# EAGLE design pardyBuzz (EAGLE 6.5.0)
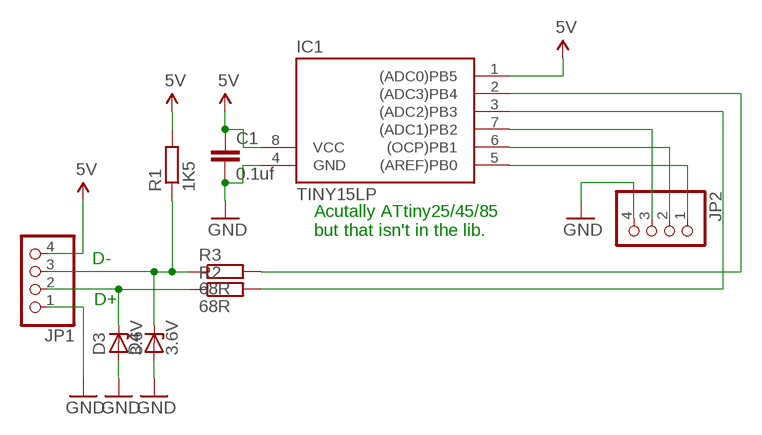
[diagram p0: schematic, sheet 1]

## Parts
C1  0.1uf  C-EU050-024X044  [C050-024X044]
D3  3.6V  ZENER-DIODEDO34-7  [DO34Z7]
D4  3.6V  ZENER-DIODEDO34-7  [DO34Z7]
IC1  TINY15LP  [DIL08]
JP1  PINHD-1X4  [1X04]
JP2  PINHD-1X4  [1X04]
R1  1K5  R-EU_0204/2V  [0204V]
R2  68R  R-EU_0204/2V  [0204V]
R3  68R  R-EU_0204/2V  [0204V]

## Nets
5V: C1.1 IC1.1((ADC0)PB5) IC1.8(VCC) JP1.4 R1.2
GND: C1.2 D3.A D4.A IC1.4(GND) JP1.1 JP2.4
N$1: IC1.3((ADC2)PB3) R2.2
N$2: D4.C JP1.3 R1.1 R3.1
N$3: D3.C JP1.2 R2.1
N$4: IC1.7((ADC1)PB2) JP2.3
N$5: IC1.6((OCP)PB1) JP2.2
N$6: IC1.2((ADC3)PB4) R3.2
N$7: IC1.5((AREF)PB0) JP2.1

## Notes on the sheet
- Acutally ATtiny25/45/85
  but that isn't in the lib.
- D-
- D+

## Library data of the parts
C1 = rcl:C-EU: CAPACITOR, European symbol
D3 D4 = diode:ZENER-DIODE: Z-Diode
IC1 = atmel:TINY15L: MICROCONTROLLER 2.7 V 1 Kbytes FLASH 64 bytes EEPROM 4-channel 10 bit ADC; OC_FARNELL: unknown; OC_NEWARK: unknown
JP1 JP2 = pinhead:PINHD-1X4: PIN HEADER
R1-R3 = rcl:R-EU_: RESISTOR, European symbol

## Board
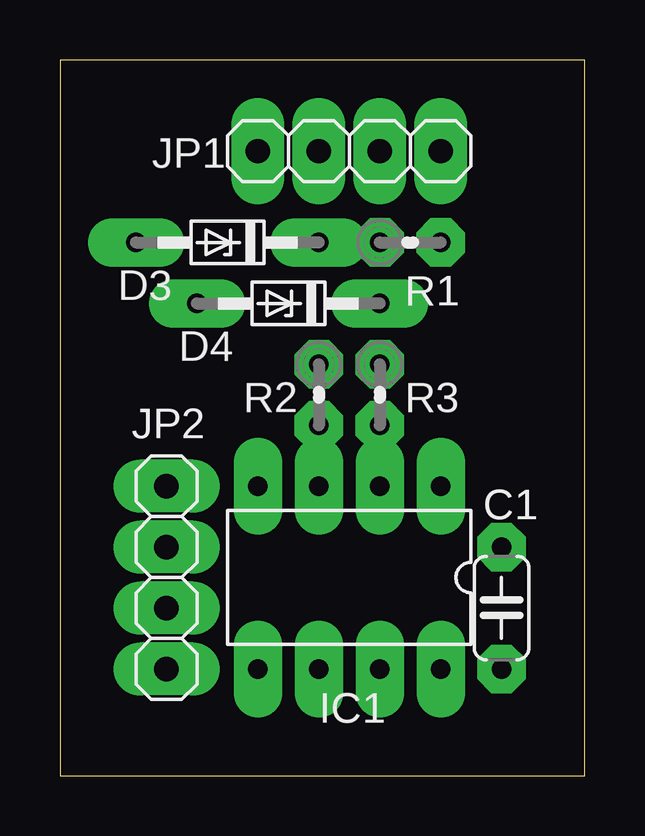
[diagram p1: board, top side]
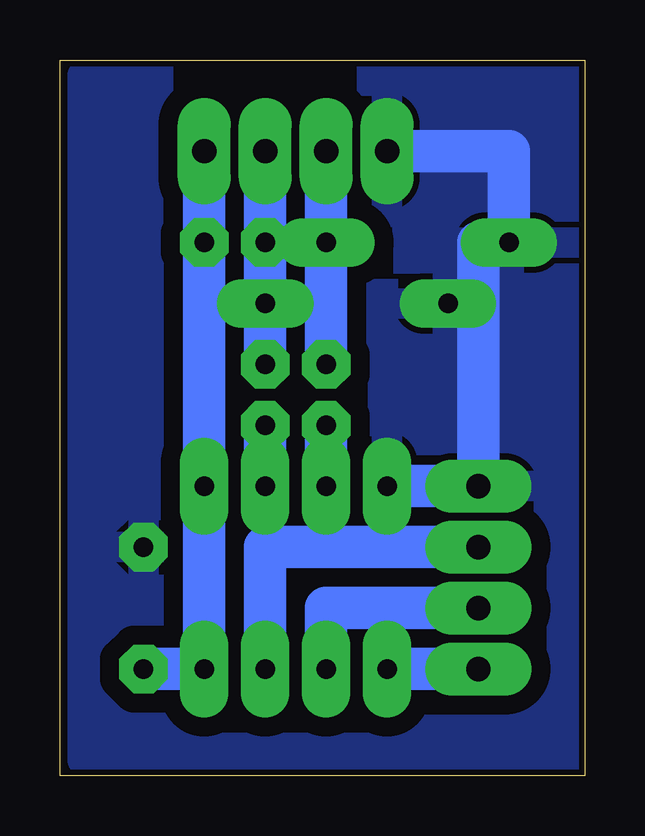
[diagram p2: board, bottom side, seen from below]

Size 21.89 x 29.84 mm. Coordinates in mm from the lower left corner, seen from the top.
Outline: 0,0 21.89,0 21.89,29.84 0,29.84 0,0
Copper layers (1*16): Top 0.035mm / dielectric 1.5mm / Bottom 0.035mm
Design rules "hobby": minimum track width 0.8mm, minimum drill 0.8mm, track to track 0.8mm, track to pad 0.8mm, pad to pad 0.45mm, via to via 0.8mm, smd to smd 8mil, copper to edge 10mil, drill to drill 8mil, minimum pad ring 0.6mm, minimum via ring 0.6mm, stop-mask expansion 0mil, vias tented up to drill 0mil, thermal gap 10mil

### Footprints (pad centres in the part's own frame; a part is rotated, then mirrored left to right if it is on the bottom)
C050-024X044 = drill 0.813 octagon: 1 -2.54,0; 2 2.54,0
DO34Z7 = drill 0.813 long: A 3.81,0; C -3.81,0
DIL08 = drill 0.813 long: 1 -3.81,-3.81; 2 -1.27,-3.81; 3 1.27,-3.81; 4 3.81,-3.81; 5 3.81,3.81; 6 1.27,3.81; 7 -1.27,3.81; 8 -3.81,3.81
1X04 = drill 1.016 long: 1 -3.81,0; 2 -1.27,0; 3 1.27,0; 4 3.81,0
0204V = drill 0.813 octagon: 1 -1.27,0; 2 1.27,0

### Placement (x,y rotation side)
C1  18.42,6.99 90 top
D3  6.98,22.23 180 top
D4  9.52,19.69 180 top
IC1  12.06,8.26 180 top
JP1  12.06,26.03 0 top
JP2  4.45,8.26 90 top
R1  14.6,22.23 0 top
R2  10.8,15.88 270 top
R3  13.34,15.88 270 top

### Tracks (layer width: path | path; a pad name or v marks a point on that pad's centre or on a via)
5V
  Bottom 1.778: JP1.4 R1.2 IC1.1 IC1.8 C1.1
GND
  Bottom 1.778: JP1.1 3.17,26.03 D3.A 4.45,22.23 4.45,19.69 | D4.A 4.45,19.69 | IC1.4 JP2.4 4.45,19.69
  pour Bottom: 0.63,29.21 20.95,29.21 20.95,0.63 0.63,0.63
N$1
  Bottom 1.778: IC1.3 R2.2
N$2
  Bottom 1.778: JP1.3 R1.1 D4.C R3.1
N$3
  Bottom 1.778: R2.1 D3.C JP1.2
N$4
  Bottom 1.778: IC1.7 13.34,9.53 JP2.3
N$5
  Bottom 1.778: IC1.6 10.8,6.99 JP2.2
N$6
  Bottom 1.778: IC1.2 R3.2
N$7
  Bottom 1.778: IC1.5 JP2.1

### Text on the board
tDocu: GND | D+ | D- | VCC | PardyBuzz / 2014 Rev. 1 | GND | PB2 | PB1 | PB0